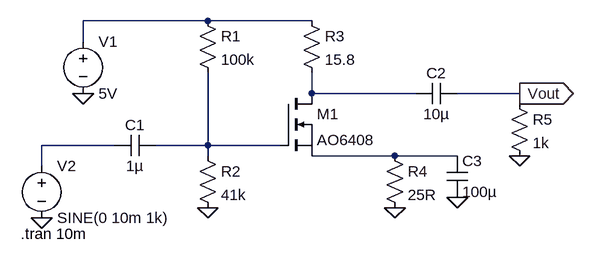
[diagram p0: schematic NNM24EE005_Adhya.asc]
NNM24EE005_Adhya.asc, the LTspice schematic file:
Version 4.1
SHEET 1 880 680
WIRE 240 48 48 48
WIRE 400 48 240 48
WIRE 48 80 48 48
WIRE 400 160 400 128
WIRE 560 160 400 160
WIRE 720 160 624 160
WIRE 720 176 720 160
WIRE 96 240 -16 240
WIRE 240 240 240 128
WIRE 240 240 160 240
WIRE 352 240 240 240
WIRE 240 256 240 240
WIRE 528 256 400 256
WIRE 624 256 528 256
WIRE -16 272 -16 240
FLAG -16 352 0
FLAG 240 336 0
FLAG 528 336 0
FLAG 624 320 0
FLAG 720 256 0
FLAG 48 160 0
FLAG 720 160 Vout
IOPIN 720 160 Out
SYMBOL voltage 48 64 R0
SYMATTR InstName V1
SYMATTR Value 5V
SYMBOL voltage -16 256 R0
WINDOW 123 0 0 Left 0
WINDOW 39 0 0 Left 0
SYMATTR InstName V2
SYMATTR Value SINE(0 10m 1k)
SYMBOL res 224 32 R0
SYMATTR InstName R1
SYMATTR Value 100k
SYMBOL res 224 240 R0
SYMATTR InstName R2
SYMATTR Value 41k
SYMBOL res 384 32 R0
SYMATTR InstName R3
SYMATTR Value 15.8
SYMBOL res 512 240 R0
SYMATTR InstName R4
SYMATTR Value 25R
SYMBOL res 704 160 R0
SYMATTR InstName R5
SYMATTR Value 1k
SYMBOL nmos 352 160 R0
SYMATTR InstName M1
SYMATTR Value AO6408
SYMBOL cap 160 224 R90
WINDOW 0 0 32 VBottom 2
WINDOW 3 32 32 VTop 2
SYMATTR InstName C1
SYMATTR Value 1µ
SYMBOL cap 624 144 R90
WINDOW 0 0 32 VBottom 2
WINDOW 3 32 32 VTop 2
SYMATTR InstName C2
SYMATTR Value 10µ
SYMBOL cap 608 256 R0
SYMATTR InstName C3
SYMATTR Value 100µ
TEXT -48 376 Left 2 !.tran 10m

The netlist it stands for:
* NNM24EE005_Adhya.asc
V1 N001 0 5V
V2 N003 0 SINE(0 10m 1k)
R1 N001 N004 100k
R2 N004 0 41k
R3 N001 N002 15.8
R4 N005 0 25R
R5 Vout 0 1k
M1 N002 N004 N005 N005 AO6408
C1 N004 N003 1µ
C2 Vout N002 10µ
C3 N005 0 100µ
.model NMOS NMOS
.model PMOS PMOS
.lib standard.mos
.tran 10m
.backanno
.end